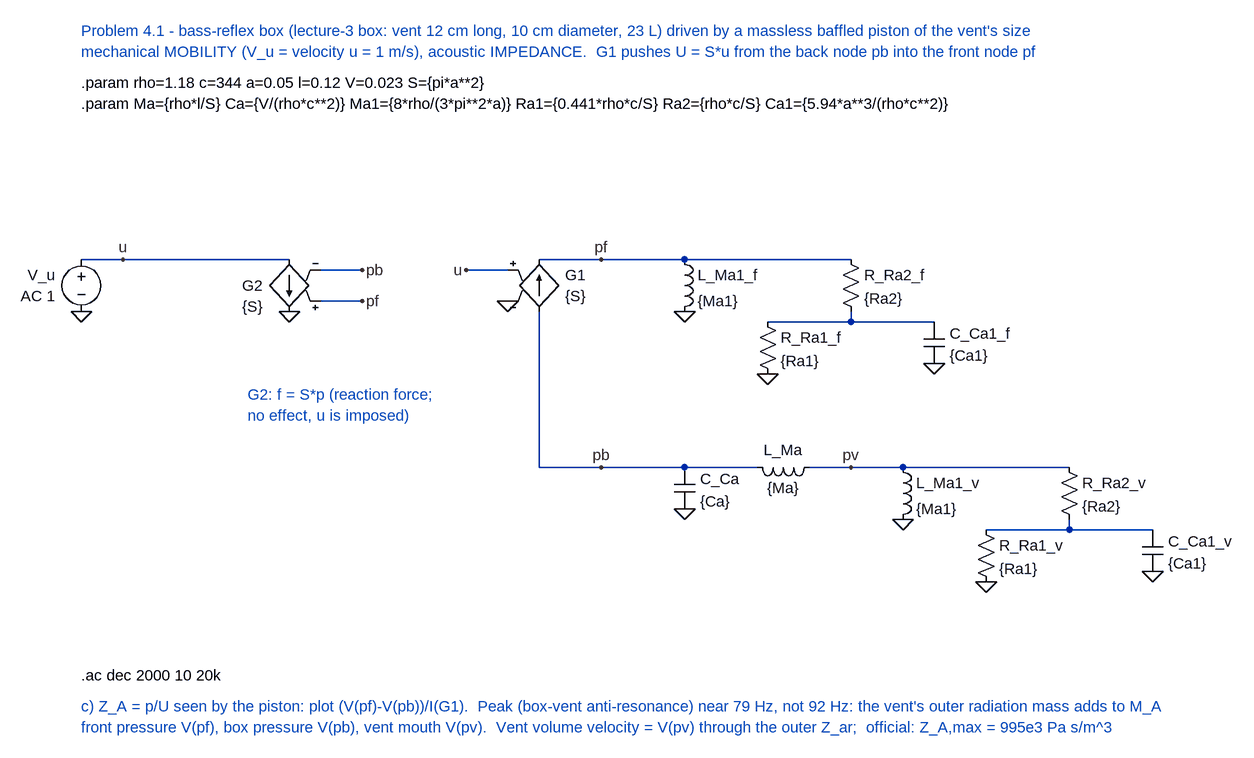
[diagram p0: schematic P4-1_BassReflex_Box.asc]
P4-1_BassReflex_Box.asc, the LTspice schematic file:
Version 4
SHEET 1 3000 1600
WIRE 0 0 320 0
WIRE 368 64 432 64
WIRE 368 16 432 16
WIRE 704 80 704 320
WIRE 656 16 592 16
WIRE 1184 80 1184 96
WIRE 1056 96 1312 96
WIRE 704 0 1184 0
WIRE 1520 400 1520 416
WIRE 1392 416 1648 416
WIRE 704 320 1040 320
WIRE 1120 320 1520 320
FLAG 0 80 0
FLAG 64 0 u
FLAG 320 80 0
FLAG 432 64 pf
FLAG 432 16 pb
FLAG 592 16 u
FLAG 656 64 0
FLAG 800 0 pf
FLAG 800 320 pb
FLAG 928 80 0
FLAG 1056 176 0
FLAG 1312 160 0
FLAG 928 384 0
FLAG 1184 320 pv
FLAG 1264 400 0
FLAG 1392 496 0
FLAG 1648 480 0
SYMBOL voltage 0 -16 R0
WINDOW 0 -40 40 Right 2
WINDOW 3 -40 72 Right 2
SYMATTR InstName V_u
SYMATTR Value AC 1
SYMBOL g 320 96 R180
WINDOW 0 40 56 Left 2
WINDOW 3 40 24 Left 2
SYMATTR InstName G2
SYMATTR Value {S}
SYMBOL g 704 -16 R0
WINDOW 0 40 40 Left 2
WINDOW 3 40 72 Left 2
SYMATTR InstName G1
SYMATTR Value {S}
SYMBOL ind 912 -16 R0
SYMATTR InstName L_Ma1_f
SYMATTR Value {Ma1}
SYMATTR SpiceLine Rser=0
SYMBOL res 1168 -16 R0
SYMATTR InstName R_Ra2_f
SYMATTR Value {Ra2}
SYMBOL res 1040 80 R0
SYMATTR InstName R_Ra1_f
SYMATTR Value {Ra1}
SYMBOL cap 1296 96 R0
WINDOW 0 40 18 Left 2
WINDOW 3 40 52 Left 2
SYMATTR InstName C_Ca1_f
SYMATTR Value {Ca1}
SYMBOL cap 912 320 R0
WINDOW 0 40 18 Left 2
WINDOW 3 40 52 Left 2
SYMATTR InstName C_Ca
SYMATTR Value {Ca}
SYMBOL ind 1136 304 R90
WINDOW 0 5 56 VBottom 2
WINDOW 3 32 56 VTop 2
SYMATTR InstName L_Ma
SYMATTR Value {Ma}
SYMATTR SpiceLine Rser=0
SYMBOL ind 1248 304 R0
SYMATTR InstName L_Ma1_v
SYMATTR Value {Ma1}
SYMATTR SpiceLine Rser=0
SYMBOL res 1504 304 R0
SYMATTR InstName R_Ra2_v
SYMATTR Value {Ra2}
SYMBOL res 1376 400 R0
SYMATTR InstName R_Ra1_v
SYMATTR Value {Ra1}
SYMBOL cap 1632 416 R0
WINDOW 0 40 18 Left 2
WINDOW 3 40 52 Left 2
SYMATTR InstName C_Ca1_v
SYMATTR Value {Ca1}
TEXT 0 -352 Left 2 ;Problem 4.1 - bass-reflex box (lecture-3 box: vent 12 cm long, 10 cm diameter, 23 L) driven by a massless baffled piston of the vent's size
TEXT 0 -320 Left 2 ;mechanical MOBILITY (V_u = velocity u = 1 m/s), acoustic IMPEDANCE.  G1 pushes U = S*u from the back node pb into the front node pf
TEXT 0 -272 Left 2 !.param rho=1.18 c=344 a=0.05 l=0.12 V=0.023 S={pi*a**2}
TEXT 0 -240 Left 2 !.param Ma={rho*l/S} Ca={V/(rho*c**2)} Ma1={8*rho/(3*pi**2*a)} Ra1={0.441*rho*c/S} Ra2={rho*c/S} Ca1={5.94*a**3/(rho*c**2)}
TEXT 256 208 Left 2 ;G2: f = S*p (reaction force;
TEXT 256 240 Left 2 ;no effect, u is imposed)
TEXT 0 640 Left 2 !.ac dec 2000 10 20k
TEXT 0 688 Left 2 ;c) Z_A = p/U seen by the piston: plot (V(pf)-V(pb))/I(G1).  Peak (box-vent anti-resonance) near 79 Hz, not 92 Hz: the vent's outer radiation mass adds to M_A
TEXT 0 720 Left 2 ;front pressure V(pf), box pressure V(pb), vent mouth V(pv).  Vent volume velocity = V(pv) through the outer Z_ar;  official: Z_A,max = 995e3 Pa s/m^3

The netlist it stands for:
* P4-1_BassReflex_Box.asc
V_u u 0 AC 1
G2 u 0 pf pb {S}
G1 pb pf u 0 {S}
L_Ma1_f pf 0 {Ma1} Rser=0
R_Ra2_f pf N001 {Ra2}
R_Ra1_f N001 0 {Ra1}
C_Ca1_f N001 0 {Ca1}
C_Ca pb 0 {Ca}
L_Ma pv pb {Ma} Rser=0
L_Ma1_v pv 0 {Ma1} Rser=0
R_Ra2_v pv N002 {Ra2}
R_Ra1_v N002 0 {Ra1}
C_Ca1_v N002 0 {Ca1}
* Problem 4.1 - bass-reflex box (lecture-3 box: vent 12 cm long, 10 cm diameter, 23 L) driven by a massless baffled piston of the vent's size
* mechanical MOBILITY (V_u = velocity u = 1 m/s), acoustic IMPEDANCE.  G1 pushes U = S*u from the back node pb into the front node pf
.param rho=1.18 c=344 a=0.05 l=0.12 V=0.023 S={pi*a**2}
.param Ma={rho*l/S} Ca={V/(rho*c**2)} Ma1={8*rho/(3*pi**2*a)} Ra1={0.441*rho*c/S} Ra2={rho*c/S} Ca1={5.94*a**3/(rho*c**2)}
* G2: f = S*p (reaction force;
* no effect, u is imposed)
.ac dec 2000 10 20k
* c) Z_A = p/U seen by the piston: plot (V(pf)-V(pb))/I(G1).  Peak (box-vent anti-resonance) near 79 Hz, not 92 Hz: the vent's outer radiation mass adds to M_A
* front pressure V(pf), box pressure V(pb), vent mouth V(pv).  Vent volume velocity = V(pv) through the outer Z_ar;  official: Z_A,max = 995e3 Pa s/m^3
.backanno
.end